# EAGLE board interface_board (EAGLE 7.1.0)
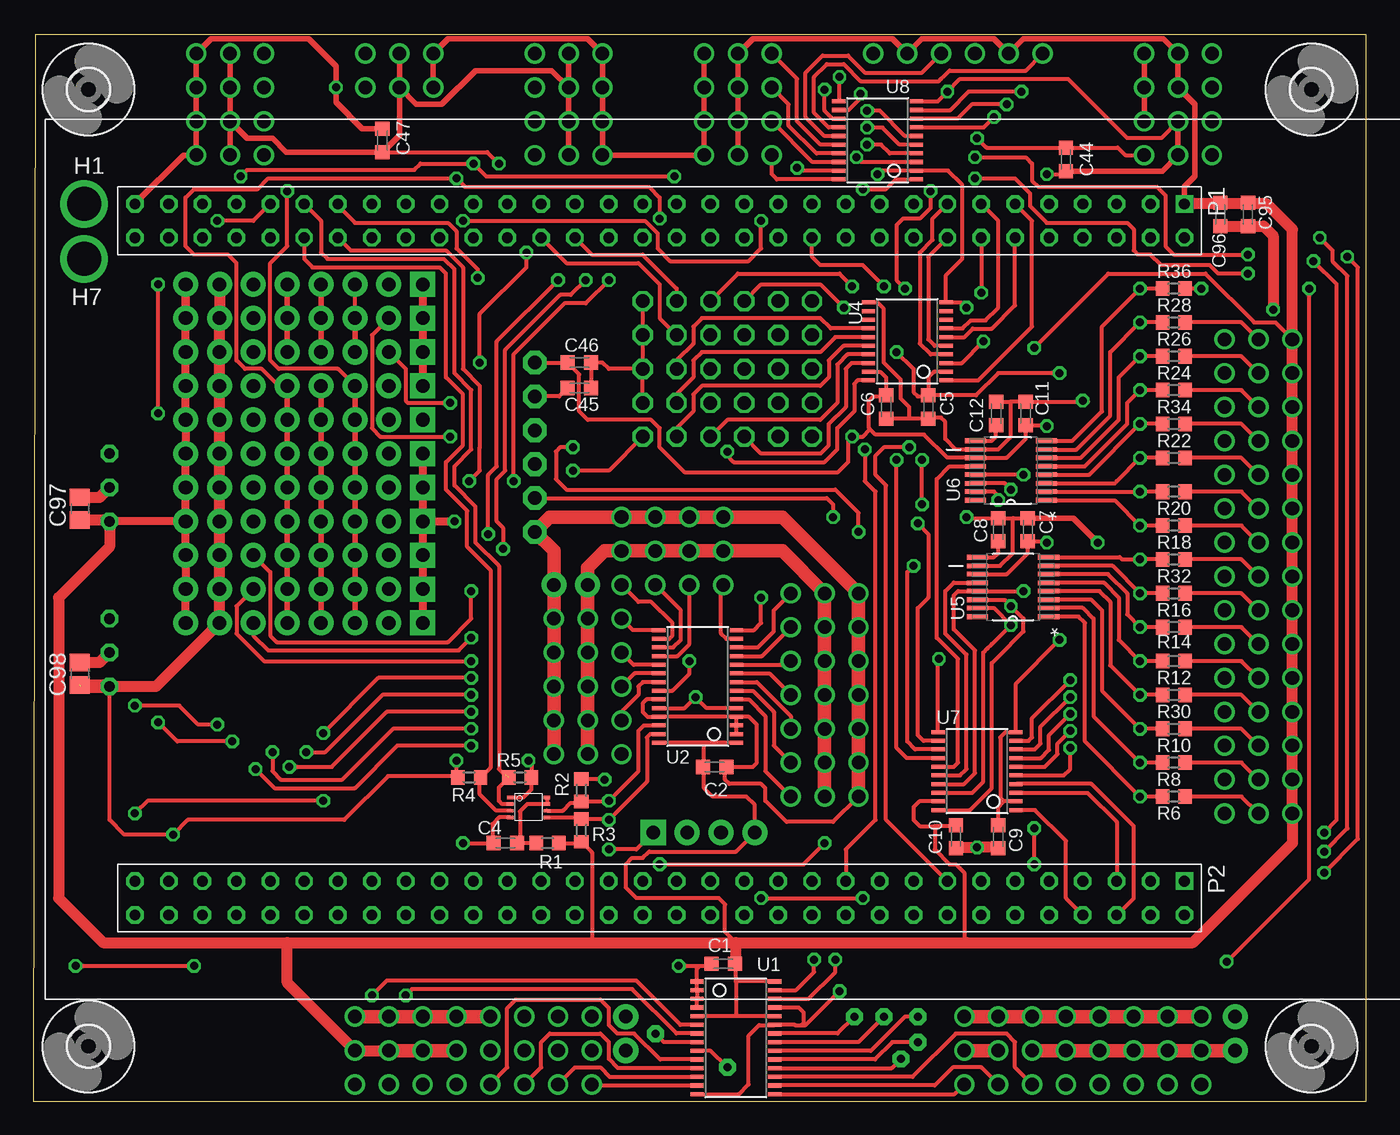
[diagram p5: board, top side]
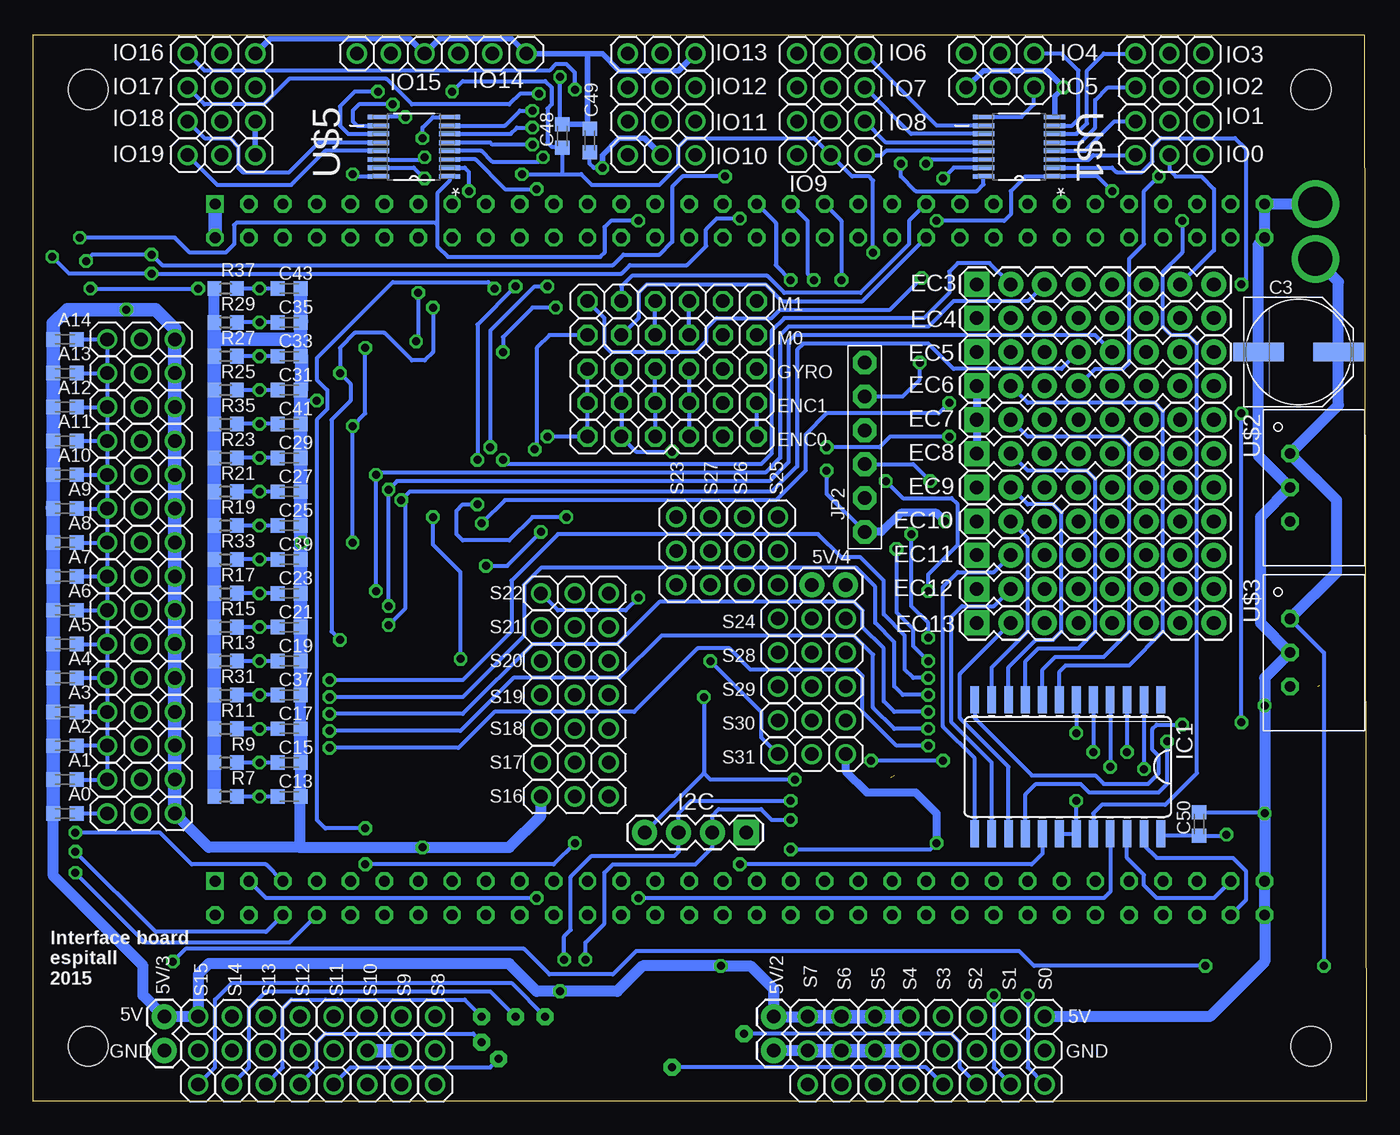
[diagram p6: board, bottom side, seen from below]

Size 100 x 80 mm. Coordinates in mm from the lower left corner, seen from the top.
Outline: 0,0 100,0 100,80 0.16,80 0,0
Copper layers (1*16): Top 0.035mm / dielectric 1.5mm / Bottom 0.035mm
Design rules "default *": minimum track width 10mil, minimum drill 10mil, track to track 6mil, track to pad 6mil, pad to pad 6mil, via to via 6mil, smd to smd 6mil, copper to edge 6mil, drill to drill 6mil, minimum pad ring 10mil, minimum via ring 8mil, stop-mask expansion 4mil, vias tented up to drill 0mil, thermal gap 10mil

## Footprints (pad centres in the part's own frame; a part is rotated, then mirrored left to right if it is on the bottom)
1X02 = drill 1.016 pad 1.88: 1 0,0; 2 2.54,0
1X03 = drill 1.016: 1 -2.54,0; 2 0,0; 3 2.54,0
C0603K = smd 1.05 x 1.08: 1 -0.875,0; 2 0.875,0
PANASONIC_E = smd 3.8 x 1.4: + 3,0; - -3,0
C0805 = smd 1.3 x 1.5: 1 -0.85,0; 2 0.85,0
1X08 = drill 1.016 pad 1.88 square: 1 0,0 | drill 1.016 pad 1.88: 2 2.54,0; 3 5.08,0; 4 7.62,0; 5 10.16,0; 6 12.7,0; 7 15.24,0; 8 17.78,0
1X06 = drill 1.016 octagon: 1 -6.35,0; 2 -3.81,0; 3 -1.27,0; 4 1.27,0; 5 3.81,0; 6 6.35,0
PAD_0.1000 = drill 2.54 pad 2.54: 1 0,0
3,0 = hole 3: 0,0
1X04 = drill 1.016 pad 1.88 square: 1 0,0 | drill 1.016 pad 1.88: 2 2.54,0; 3 5.08,0; 4 7.62,0
SO24W = smd 0.66 x 2.032: 1 -6.985,-5.029; 2 -5.715,-5.029; 3 -4.445,-5.029; 4 -3.175,-5.029; 5 -1.905,-5.029; 6 -0.635,-5.029; 7 0.635,-5.029; 8 1.905,-5.029; 9 3.175,-5.029; 10 4.445,-5.029; 11 5.715,-5.029; 12 6.985,-5.029; 13 6.985,5.029; 14 5.715,5.029; 15 4.445,5.029; 16 3.175,5.029; 17 1.905,5.029; 18 0.635,5.029; 19 -0.635,5.029; 20 -1.905,5.029; 21 -3.175,5.029; 22 -4.445,5.029; 23 -5.715,5.029; 24 -6.985,5.029
1X06-BIG = drill 1.016 pad 1.778 octagon: 1 -6.35,0; 2 -3.81,0; 3 -1.27,0; 4 1.27,0; 5 3.81,0; 6 6.35,0
R0603 = smd 1 x 1.1: 1 -0.85,0; 2 0.85,0
TSSOP28 = smd 0.305 x 0.991: 1 -4.225,-2.918; 2 -3.575,-2.918; 3 -2.925,-2.918; 4 -2.275,-2.918; 5 -1.625,-2.918; 6 -0.975,-2.918; 7 -0.325,-2.918; 8 0.325,-2.918; 9 0.975,-2.918; 10 1.625,-2.918; 11 2.275,-2.918; 12 2.925,-2.918; 13 3.575,-2.918; 14 4.225,-2.918; 15 4.225,2.918; 16 3.575,2.918; 17 2.925,2.918; 18 2.275,2.918; 19 1.625,2.918; 20 0.975,2.918; 21 0.325,2.918; 22 -0.325,2.918; 23 -0.975,2.918; 24 -1.625,2.918; 25 -2.275,2.918; 26 -2.925,2.918; 27 -3.575,2.918; 28 -4.225,2.918
PSOP-8 = smd 0.25 x 0.5: 1 -0.73,-1.37; 2 -0.23,-1.37; 3 0.27,-1.37; 4 0.77,-1.37; 5 0.77,1.38; 6 0.27,1.38; 7 -0.23,1.38; 8 -0.73,1.38
TSSOP20 = smd 0.305 x 0.991: 1 -2.925,-2.918; 2 -2.275,-2.918; 3 -1.625,-2.918; 4 -0.975,-2.918; 5 -0.325,-2.918; 6 0.325,-2.918; 7 0.975,-2.918; 8 1.625,-2.918; 9 2.275,-2.918; 10 2.925,-2.918; 11 2.925,2.918; 12 2.275,2.918; 13 1.625,2.918; 14 0.975,2.918; 15 0.325,2.918; 16 -0.325,2.918; 17 -0.975,2.918; 18 -1.625,2.918; 19 -2.275,2.918; 20 -2.925,2.918
SOP63P602X175-16N = smd 1.6 x 0.356: 1 -2.667,2.235; 2 -2.667,1.575; 3 -2.667,0.965; 4 -2.667,0.305; 5 -2.667,-0.305; 6 -2.667,-0.965; 7 -2.667,-1.575; 8 -2.667,-2.235; 9 2.667,-2.235; 10 2.667,-1.575; 11 2.667,-0.965; 12 2.667,-0.305; 13 2.667,0.305; 14 2.667,0.965; 15 2.667,1.575; 16 2.667,2.235
SOP63P600X175-16N = smd 1.6 x 0.356: 1 -2.667,2.235; 2 -2.667,1.575; 3 -2.667,0.965; 4 -2.667,0.305; 5 -2.667,-0.305; 6 -2.667,-0.965; 7 -2.667,-1.575; 8 -2.667,-2.235; 9 2.667,-2.235; 10 2.667,-1.575; 11 2.667,-0.965; 12 2.667,-0.305; 13 2.667,0.305; 14 2.667,0.965; 15 2.667,1.575; 16 2.667,2.235
TSR-1 = drill 0.8 octagon: P$1 0,0; P$2 2.54,0; P$3 5.08,0
STM32F429IDISCOVERY = drill 0.8 square: P$1 -27.94,35.56; P$65 22.86,35.56 | drill 0.8 octagon: P$2 -25.4,35.56; P$3 -27.94,33.02; P$4 -25.4,33.02; P$5 -27.94,30.48; P$6 -25.4,30.48; P$7 -27.94,27.94; P$8 -25.4,27.94; P$9 -27.94,25.4; P$10 -25.4,25.4; P$11 -27.94,22.86; P$12 -25.4,22.86; P$13 -27.94,20.32; P$14 -25.4,20.32; P$15 -27.94,17.78; P$16 -25.4,17.78; P$17 -27.94,15.24; P$18 -25.4,15.24; P$19 -27.94,12.7; P$20 -25.4,12.7; P$21 -27.94,10.16; P$22 -25.4,10.16; P$23 -27.94,7.62; P$24 -25.4,7.62; P$25 -27.94,5.08; P$26 -25.4,5.08; P$27 -27.94,2.54; P$28 -25.4,2.54; P$29 -27.94,0; P$30 -25.4,0; P$31 -27.94,-2.54; P$32 -25.4,-2.54; P$33 -27.94,-5.08; P$34 -25.4,-5.08; P$35 -27.94,-7.62; P$36 -25.4,-7.62; P$37 -27.94,-10.16; P$38 -25.4,-10.16; P$39 -27.94,-12.7; P$40 -25.4,-12.7; P$41 -27.94,-15.24; P$42 -25.4,-15.24; P$43 -27.94,-17.78; P$44 -25.4,-17.78; P$45 -27.94,-20.32; P$46 -25.4,-20.32; P$47 -27.94,-22.86; P$48 -25.4,-22.86; P$49 -27.94,-25.4; P$50 -25.4,-25.4; P$51 -27.94,-27.94; P$52 -25.4,-27.94; P$53 -27.94,-30.48; P$54 -25.4,-30.48; P$55 -27.94,-33.02; P$56 -25.4,-33.02; P$57 -27.94,-35.56; P$58 -25.4,-35.56; P$59 -27.94,-38.1; P$60 -25.4,-38.1; P$61 -27.94,-40.64; P$62 -25.4,-40.64; P$63 -27.94,-43.18; P$64 -25.4,-43.18; P$66 25.4,35.56; P$67 22.86,33.02; P$68 25.4,33.02; P$69 22.86,30.48; P$70 25.4,30.48; P$71 22.86,27.94; P$72 25.4,27.94; P$73 22.86,25.4; P$74 25.4,25.4; P$75 22.86,22.86; P$76 25.4,22.86; P$77 22.86,20.32; P$78 25.4,20.32; P$79 22.86,17.78; P$80 25.4,17.78; P$81 22.86,15.24; P$82 25.4,15.24; P$83 22.86,12.7; P$84 25.4,12.7; P$85 22.86,10.16; P$86 25.4,10.16; P$87 22.86,7.62; P$88 25.4,7.62; P$89 22.86,5.08; P$90 25.4,5.08; P$91 22.86,2.54; P$92 25.4,2.54; P$93 22.86,0; P$94 25.4,0; P$95 22.86,-2.54; P$96 25.4,-2.54; P$97 22.86,-5.08; P$98 25.4,-5.08; P$99 22.86,-7.62; P$100 25.4,-7.62; P$101 22.86,-10.16; P$102 25.4,-10.16; P$103 22.86,-12.7; P$104 25.4,-12.7; P$105 22.86,-15.24; P$106 25.4,-15.24; P$107 22.86,-17.78; P$108 25.4,-17.78; P$109 22.86,-20.32; P$110 25.4,-20.32; P$111 22.86,-22.86; P$112 25.4,-22.86; P$113 22.86,-25.4; P$114 25.4,-25.4; P$115 22.86,-27.94; P$116 25.4,-27.94; P$117 22.86,-30.48; P$118 25.4,-30.48; P$119 22.86,-33.02; P$120 25.4,-33.02; P$121 22.86,-35.56; P$122 25.4,-35.56; P$123 22.86,-38.1; P$124 25.4,-38.1; P$125 22.86,-40.64; P$126 25.4,-40.64; P$127 22.86,-43.18; P$128 25.4,-43.18

## Placement (x,y rotation side)
5V/2  M02PTH  [1X02]  44.45,6.35 270 bottom
5V/3  M02PTH  [1X02]  90.17,6.35 270 bottom
5V/4  M02PTH  [1X02]  39.05,38.73 180 bottom
A0  [1X03]  91.92,21.59 0 bottom
A1  [1X03]  91.92,24.13 0 bottom
A2  [1X03]  91.92,26.67 0 bottom
A3  [1X03]  91.92,29.21 0 bottom
A4  [1X03]  91.92,31.75 0 bottom
A5  [1X03]  91.92,34.29 0 bottom
A6  [1X03]  91.92,36.83 0 bottom
A7  [1X03]  91.92,39.37 0 bottom
A8  [1X03]  91.92,41.91 0 bottom
A9  [1X03]  91.92,44.45 0 bottom
A10  [1X03]  91.92,46.99 0 bottom
A11  [1X03]  91.92,49.53 0 bottom
A12  [1X03]  91.92,52.07 0 bottom
A13  [1X03]  91.92,54.61 0 bottom
A14  [1X03]  91.92,57.15 0 bottom
C1  [C0603K]  51.75,10.32 180 top
C2  [C0603K]  51.12,25.08 0 top
C3  100u/25V  [PANASONIC_E]  5.08,56.2 0 bottom
C4  100n  [C0603K]  35.4,19.37 180 top
C5  100n  [C0603K]  67.15,52.07 270 top
C6  100n  [C0603K]  63.98,52.07 270 top
C7  100n  [C0603K]  74.61,42.86 90 top
C8  100n  [C0603K]  72.39,42.86 90 top
C9  100n  [C0603K]  72.39,19.84 270 top
C10  100n  [C0603K]  69.22,19.84 270 top
C11  100n  [C0603K]  74.45,51.59 90 top
C12  100n  [C0603K]  72.23,51.59 90 top
C13  [C0603K]  80.8,22.86 0 bottom
C14  100n  [C0603K]  97.63,21.59 180 bottom
C15  [C0603K]  80.8,25.4 0 bottom
C16  100n  [C0603K]  97.63,57.15 180 bottom
C17  [C0603K]  80.8,27.94 0 bottom
C18  100n  [C0603K]  97.63,54.61 180 bottom
C19  [C0603K]  80.8,33.02 0 bottom
C20  100n  [C0603K]  97.63,49.53 180 bottom
C21  [C0603K]  80.8,35.56 0 bottom
C22  100n  [C0603K]  97.63,46.99 180 bottom
C23  [C0603K]  80.8,38.1 0 bottom
C24  100n  [C0603K]  97.63,44.45 180 bottom
C25  [C0603K]  80.8,43.18 0 bottom
C26  100n  [C0603K]  97.63,39.37 180 bottom
C27  [C0603K]  80.8,45.72 0 bottom
C28  100n  [C0603K]  97.63,36.83 180 bottom
C29  [C0603K]  80.8,48.26 0 bottom
C30  100n  [C0603K]  97.63,34.29 180 bottom
C31  [C0603K]  80.8,53.34 0 bottom
C32  100n  [C0603K]  97.63,29.21 180 bottom
C33  [C0603K]  80.8,55.88 0 bottom
C34  100n  [C0603K]  97.63,26.67 180 bottom
C35  [C0603K]  80.8,58.42 0 bottom
C36  100n  [C0603K]  97.63,24.13 180 bottom
C37  [C0603K]  80.8,30.48 0 bottom
C38  100n  [C0603K]  97.63,52.07 180 bottom
C39  [C0603K]  80.8,40.64 0 bottom
C40  100n  [C0603K]  97.63,41.91 180 bottom
C41  [C0603K]  80.8,50.8 0 bottom
C42  100n  [C0603K]  97.63,31.75 180 bottom
C43  [C0603K]  80.8,60.96 0 bottom
C44  100n  [C0603K]  77.47,70.64 90 top
C45  100n  [C0603K]  40.96,53.5 0 top
C46  100n  [C0603K]  40.96,55.4 0 top
C47  100n  [C0603K]  26.19,72.07 90 top
C48  100n  [C0603K]  60.33,72.39 90 bottom
C49  100n  [C0603K]  58.26,72.07 90 bottom
C50  100n  [C0603K]  12.54,20.8 90 bottom
C95  100n  [C0603K]  91.12,66.52 270 top
C96  100n  [C0603K]  89.06,66.52 270 top
C97  [C0805]  3.49,44.45 90 top
C98  [C0805]  3.49,32.07 90 top
EC3  [1X08]  29.21,61.28 0 bottom
EC4  [1X08]  29.21,58.74 0 bottom
EC5  [1X08]  29.21,56.2 0 bottom
EC6  [1X08]  29.21,53.66 0 bottom
EC7  [1X08]  29.21,51.12 0 bottom
EC8  [1X08]  29.21,48.58 0 bottom
EC9  [1X08]  29.21,46.04 0 bottom
EC10  [1X08]  29.21,43.5 0 bottom
EC11  [1X08]  29.21,40.96 0 bottom
EC12  [1X08]  29.21,38.42 0 bottom
EC13  [1X08]  29.21,35.88 0 bottom
ENC0  [1X06]  52.07,49.85 180 bottom
ENC1  [1X06]  52.07,52.39 180 bottom
GYRO  [1X06]  52.07,54.93 180 bottom
H1  SPECIAL_DRILL_0.1000  [PAD_0.1000]  3.81,67.31 0 top
H3  MOUNT-HOLE3.0  [3,0]  4.13,75.88 0 top
H4  MOUNT-HOLE3.0  [3,0]  4.13,4.13 0 top
H5  MOUNT-HOLE3.0  [3,0]  95.89,75.88 0 top
H6  MOUNT-HOLE3.0  [3,0]  95.89,4.13 0 top
H7  SPECIAL_DRILL_0.1000  [PAD_0.1000]  3.81,63.18 0 top
I2C  [1X04]  46.51,20.16 180 bottom
IC1  74HC154DW  [SO24W]  22.38,25.08 180 bottom
IO0  [1X03]  14.76,70.96 0 bottom
IO1  [1X03]  14.76,73.5 0 bottom
IO2  [1X03]  14.76,76.04 0 bottom
IO3  [1X03]  14.76,78.58 0 bottom
IO4  [1X03]  27.46,78.58 180 bottom
IO5  [1X03]  27.46,76.04 180 bottom
IO6  [1X03]  40.16,78.58 180 bottom
IO7  [1X03]  40.16,76.04 180 bottom
IO8  [1X03]  40.16,73.5 180 bottom
IO9  [1X03]  40.16,70.96 180 bottom
IO10  [1X03]  52.86,70.96 0 bottom
IO11  [1X03]  52.86,73.5 0 bottom
IO12  [1X03]  52.86,76.04 0 bottom
IO13  [1X03]  52.86,78.58 0 bottom
IO14  [1X03]  65.56,78.58 0 bottom
IO15  [1X03]  73.18,78.58 0 bottom
IO16  [1X03]  85.88,78.58 0 bottom
IO17  [1X03]  85.88,76.04 0 bottom
IO18  [1X03]  85.88,73.5 0 bottom
IO19  [1X03]  85.88,70.96 0 bottom
JP2  [1X06-BIG]  37.62,49.05 270 bottom
M0  [1X06]  52.07,57.47 180 bottom
M1  [1X06]  52.07,60.01 180 bottom
R1  200k  [R0603]  38.58,19.37 0 top
R2  4k7  [R0603]  41.12,23.34 90 top
R3  4k7  [R0603]  41.12,20.32 270 top
R4  4k7  [R0603]  32.7,24.29 180 top
R5  4k7  [R0603]  36.51,24.29 0 top
R6  [R0603]  85.57,22.86 0 top
R7  [R0603]  85.57,22.86 180 bottom
R8  [R0603]  85.57,25.4 0 top
R9  [R0603]  85.57,25.4 180 bottom
R10  [R0603]  85.57,27.94 0 top
R11  [R0603]  85.57,27.94 180 bottom
R12  [R0603]  85.57,33.02 0 top
R13  [R0603]  85.57,33.02 180 bottom
R14  [R0603]  85.57,35.56 0 top
R15  [R0603]  85.57,35.56 180 bottom
R16  [R0603]  85.57,38.1 0 top
R17  [R0603]  85.57,38.1 180 bottom
R18  [R0603]  85.57,43.18 0 top
R19  [R0603]  85.57,43.18 180 bottom
R20  [R0603]  85.57,45.72 0 top
R21  [R0603]  85.57,45.72 180 bottom
R22  [R0603]  85.57,48.26 0 top
R23  [R0603]  85.57,48.26 180 bottom
R24  [R0603]  85.57,53.34 0 top
R25  [R0603]  85.57,53.34 180 bottom
R26  [R0603]  85.57,55.88 0 top
R27  [R0603]  85.57,55.88 180 bottom
R28  [R0603]  85.57,58.42 0 top
R29  [R0603]  85.57,58.42 180 bottom
R30  [R0603]  85.57,30.48 0 top
R31  [R0603]  85.57,30.48 180 bottom
R32  [R0603]  85.57,40.64 0 top
R33  [R0603]  85.57,40.64 180 bottom
R34  [R0603]  85.57,50.8 0 top
R35  [R0603]  85.57,50.8 180 bottom
R36  [R0603]  85.57,60.96 0 top
R37  [R0603]  85.57,60.96 180 bottom
S0  [1X03]  24.13,3.81 90 bottom
S1  [1X03]  26.67,3.81 90 bottom
S2  [1X03]  29.21,3.81 90 bottom
S3  [1X03]  31.75,3.81 90 bottom
S4  [1X03]  34.29,3.81 90 bottom
S5  [1X03]  36.83,3.81 90 bottom
S6  [1X03]  39.37,3.81 90 bottom
S7  [1X03]  41.91,3.81 90 bottom
S8  [1X03]  69.85,3.81 90 bottom
S9  [1X03]  72.39,3.81 90 bottom
S10  [1X03]  74.93,3.81 90 bottom
S11  [1X03]  77.47,3.81 90 bottom
S12  [1X03]  80.01,3.81 90 bottom
S13  [1X03]  82.55,3.81 90 bottom
S14  [1X03]  85.09,3.81 90 bottom
S15  [1X03]  87.63,3.81 90 bottom
S16  [1X03]  59.37,22.86 180 bottom
S17  [1X03]  59.37,25.4 180 bottom
S18  [1X03]  59.37,27.94 180 bottom
S19  [1X03]  59.37,30.48 180 bottom
S20  [1X03]  59.37,33.02 180 bottom
S21  [1X03]  59.37,35.56 180 bottom
S22  [1X03]  59.37,38.1 180 bottom
S23  [1X03]  51.75,41.27 90 bottom
S24  [1X03]  41.59,36.2 0 bottom
S25  [1X03]  44.13,41.27 90 bottom
S26  [1X03]  46.67,41.27 90 bottom
S27  [1X03]  49.21,41.27 90 bottom
S28  [1X03]  41.59,33.66 0 bottom
S29  [1X03]  41.59,31.11 0 bottom
S30  [1X03]  41.59,28.57 0 bottom
S31  [1X03]  41.59,26.04 0 bottom
U1  [TSSOP28]  52.7,4.76 270 top
U2  [TSSOP28]  49.85,31.11 90 top
U3  PCA9306  [PSOP-8]  37.15,22.07 270 top
U4  [TSSOP20]  65.56,56.99 90 top
U5  MAX11628EEE+  [SOP63P602X175-16N]  73.5,38.58 180 top
U6  MAX11628EEE+  [SOP63P602X175-16N]  73.34,47.31 180 top
U7  [TSSOP20]  70.8,24.77 90 top
U8  [TSSOP20]  63.34,72.07 90 top
U$1  MAX7317  [SOP63P600X175-16N]  26.04,71.6 180 bottom
U$2  TSR_1-2450  [TSR-1]  5.71,48.58 270 bottom
U$3  TSR_1-2433  [TSR-1]  5.71,36.2 270 bottom
U$4  STM32F429IDISCOVERY  [STM32F429IDISCOVERY]  50.8,39.37 270 top
U$5  MAX7317  [SOP63P600X175-16N]  71.44,71.6 180 bottom

## Tracks (layer width: path | path; a pad name or v marks a point on that pad's centre or on a via)
+3V3  (via drill 0.6, 0.6 pad 1.02)  (1 unrouted)
  Top 0.305: U8.10 67.85,75 v68.58,75.72 69.53,76.68 77.63,76.68 82.07,72.23 84.61,72.23 IO18.2 | v76.04,69.53 77.23,69.53 C44.1 | C9.1 72.39,22.07 72.81,22.49 | U7.2 72.81,22.49 | U4.2 67.58,54.72 67.15,54.29 C5.1 | C47.1 34.05,71.2 v34.92,70.33 | U3.1 36.77,22.8 37.36,23.39 R5.2 37.36,25.34 v37.15,25.56 | R4.2 31.75,24.39 | 31.75,24.39 v31.75,25.56 | U$3.P$3 5.71,21.11 6.83,20 v10.48,20 11.59,21.11 23.34,21.11 26.61,24.39 31.75,24.39 | 72.81,22.49 72.55,22.75 72.55,27.3 72.93,27.69 U7.10 73.72,31.33 v76.99,34.61 | v76.99,54.61 72.39,54.61 70.72,52.95 C5.1 | v63.34,69.53 63.61,69.8 U8.2 68.63,69.8 69.69,68.74 69.69,63.18 68.48,61.97 U4.10 69.62,59.92 v70.01,59.53 | M1.4 54.61,61.28 59.05,61.28 v60.8,59.53 | C5.1 67.07,52.86 66.36,52.86 66.04,53.18 66.04,54.93 v64.77,56.2 | v33.5,55.4 33.5,59.05 36.99,62.55 v36.99,63.66 | C45.1 39.45,52.86 JP2.2
  Top 0.406: IO5.2 27.46,72.47 C47.1 18.97,71.2 17.94,72.23 16.03,72.23 IO1.2 | IO5.2 IO4.2 | IO1.2 IO0.2 | IO1.2 IO2.2 IO3.2 | IO7.2 IO8.2 IO9.2 | IO7.2 38.89,77.31 33.18,77.31 30.64,74.77 28.73,74.77 IO5.2 | IO6.2 IO7.2 | IO18.2 IO19.2 84.69,69.77 C44.1
  Top 0.61: EC4.7 EC5.7 EC6.7 EC7.7 EC8.7 EC9.7 EC10.7 EC11.7 EC12.7
  Top 0.813: U$3.P$3 9.21,31.11 EC13.7 EC4.7 EC3.7
  Top 1.016: U$3.P$3 3.6,31.11
  Bottom 0.305: 60.33,69.53 C48.1 60.41,71.6 61.12,71.6 61.44,71.91 61.44,74.45 61.12,74.77 61.12,76.04 61.59,76.52 67.79,76.52 v68.58,75.72 | U$5.16 75.87,69.36 v76.04,69.53 | M0.4 M1.4 | U$1.16 28.7,68.77 29.21,68.26 33.81,68.26 34.92,69.37 v34.92,70.33 | v31.75,25.56 v37.15,25.56 | IC1.24 15.27,19.92 C50.1 10.56,19.92 v10.48,20 | IO0.2 14.76,69.85 14.29,69.37 12.38,69.37 11.43,68.42 11.43,63.82 EC3.7 | v76.99,34.61 77.63,35.24 77.63,51.12 76.2,52.55 76.2,53.82 v76.99,54.61 76.99,56.52 75.88,57.63 73.66,57.63 71.6,55.56 70.64,55.56 70.01,56.2 v70.01,59.53 | v60.8,59.53 62.55,59.53 64.77,57.31 v64.77,56.2 | v63.34,69.53 60.33,69.53 | 60.33,69.53 58.9,69.53 58.1,68.74 53.02,68.74 51.59,70.17 51.59,71.6 50.96,72.23 41.43,72.23 IO9.2 38.58,69.37 37.31,69.37 36.99,69.06 v36.99,63.66 | JP2.2 34.77,52.86 33.5,54.13 v33.5,55.4
+5V/1  (via drill 0.6, 0.6 pad 1.02)
  Top 0.305: U1.24 52.7,6.39 | 52.7,6.39 U1.5 | 52.7,8.99 52.7,6.39 | U1.28 52.7,8.99 | U8.19 57.52,69.8 v57.31,70.01 | U5.11 73.04,39.54 74.61,41.12 C7.1 75.96,41.99 v76.04,41.91 | C11.1 74.45,49.69 73.04,48.27 U6.11 68.57,48.27 66.83,50.01 63.18,50.01 62.79,50.4 | 74.53,50.64 C11.1 | U7.19 66.46,22.49 66.04,22.07 66.04,21.11 66.52,20.64 67.63,20.64 | U4.19 63.55,54.72 63.98,54.29 C6.1 63.9,52.86 63.02,52.86 62.71,52.55 62.71,50.48 62.79,50.4 | R1.2 41.01,19.37 R3.2 41.91,18.68 41.91,11.91 | 52.7,8.99 52.7,10.24 C1.1 | 50.16,25 C2.1 50.32,25 | 52.7,11.91 51.91,12.7 51.91,14.76 51.44,15.24 45.24,15.24 44.45,16.03 44.45,17.78 44.93,18.26 45.72,18.26 46.2,18.73 52.7,18.73 I2C.4 54.13,22.23 53.5,22.86 50.96,22.86 50.32,23.5 50.32,25 | U2.1 50.32,26.89 | 50.32,26.89 U2.28 | 50.32,25 50.32,26.89 | U2.24 48.86,29.49 v49.69,30.32 50.52,29.49 U2.5 | R2.2 42.81,24.19 v42.86,24.13 | 67.63,20.64 69.13,20.64 C10.1 | 67.63,20.64 67.63,18.89 68.74,17.78 69.22,17.78 69.85,17.14 69.85,12.06 70.01,11.91 | JP2.1 C46.1 40.96,54.53 40.96,51.75 41.59,51.12 46.35,51.12 46.99,50.48 46.99,49.05 48.9,47.15 60.33,47.15 61.12,47.94 61.12,49.53 v61.44,49.85 62.23,49.85 62.79,50.4 | v75.09,56.52 80.64,62.07 87.95,62.07 91.6,58.42 93.19,58.42 A14.1 | C11.1 75.96,50.72 v76.04,50.64
  Top 0.406: IO10.2 IO11.2 IO12.2 IO13.2 53.98,79.69 64.45,79.69 IO14.2 66.67,79.69 72.07,79.69 IO15.2 74.3,79.69 84.77,79.69 IO16.2 IO17.2 87.15,74.77 87.15,69.37 86.36,68.58 U$4.P$1
  Top 0.61: EC3.8 EC4.8 | EC13.8 EC12.8 EC11.8 EC10.8 | EC10.8 EC9.8 EC8.8 EC7.8 EC6.8 EC5.8 EC4.8 | EC4.8 11.43,61.44 | EC10.8 U$2.P$3
  Top 0.813: 19.05,11.91 5.24,11.91 1.91,15.24 1.91,37.78 5.71,41.59 U$2.P$3 5.61,43.6 C97.1 | 19.05,11.91 41.91,11.91 52.7,11.91 | 52.7,11.91 70.01,11.91 87,11.91 94.46,19.37 94.46,21.27 94.61,21.43 A0.1 A1.1 A14.1 94.46,65.41 92.55,67.31 91.2,67.31 | 91.2,67.31 89.06,67.31 | 89.06,67.31 U$4.P$1 | C96.1 89.06,67.31 | C95.1 91.2,67.31 | 19.05,11.91 19.05,8.89 S0.2 S1.2 | C1.1 52.7,10.4 52.7,11.91
  Top 1.016: S3.2 S2.2 S1.2
  Bottom 0.305: A13.1 A14.1 C16.1 | A13.1 A12.1 | A12.1 A11.1 | A11.1 A10.1 | A10.1 A9.1 | A9.1 A8.1 | A8.1 A7.1 | A7.1 A6.1 | A6.1 A5.1 | A5.1 A4.1 | A4.1 A3.1 | A3.1 A2.1 | A2.1 A1.1 C36.1 | C18.1 A13.1 | C38.1 A12.1 | C20.1 A11.1 | C22.1 A10.1 | C24.1 A9.1 | C40.1 A8.1 | C26.1 A7.1 | C28.1 A6.1 | C30.1 A5.1 | C32.1 A3.1 | C42.1 A4.1 | v57.31,70.01 57.94,70.01 58.26,70.33 C49.1 | v76.04,41.91 v76.04,50.64 75.09,51.59 v75.09,56.52 | A2.1 C34.1 | C14.1 A0.1 | v49.69,30.32 49.69,24.61 | 49.69,24.61 I2C.4 | v42.86,24.13 49.21,24.13 49.69,24.61 | GYRO.6 ENC1.6 ENC0.6 v61.44,49.85
  Bottom 0.406: v57.31,70.01 57.31,70.96 56.04,72.23 54.13,72.23 IO10.2
  Bottom 1.016: U$4.P$1 U$4.P$2
+5V/2
  Bottom 0.813: S7.2 5V/2.2
  Bottom 1.016: S4.2 S5.2 S6.2 S7.2
+5V/3
  Top 1.016: S10.2 S11.2 S12.2 S13.2 S14.2 S15.2 5V/3.2 | S9.2 S8.2
  Bottom 1.016: S10.2 S9.2
+5V/4
  Top 1.016: S16.2 S17.2 S18.2 S19.2 S20.2 S21.2 S22.2 56.2,41.27 S23.2 S27.2 S26.2 S25.2 42.86,41.27 41.59,40.01 5V/4.2 S24.2 S28.2 S29.2 S30.2 S31.2
ADC_CH0  (via drill 0.6 pad 1.02)
  Top 0.305: R7.1 v83.03,22.86 78.9,26.99 78.9,35.88 78.42,36.35 76.18,36.35 U5.1
  Bottom 0.305: C13.1 v83.03,22.86 R7.1
ADC_CH1  (via drill 0.6 pad 1.02)
  Top 0.305: R9.1 v83.03,25.4 79.53,28.89 79.53,36.2 78.73,37 U5.2
  Bottom 0.305: C15.1 v83.03,25.4 R9.1
ADC_CH2  (via drill 0.6 pad 1.02)
  Top 0.305: R11.1 v83.03,27.94 80.17,30.8 80.17,36.83 79.39,37.61 U5.3
  Bottom 0.305: C17.1 v83.03,27.94 R11.1
ADC_CH3  (via drill 0.6 pad 1.02)
  Top 0.305: R31.1 v83.03,30.48 80.8,32.7 80.8,37.47 80,38.27 U5.4
  Bottom 0.305: C37.1 v83.03,30.48 R31.1
ADC_CH4  (via drill 0.6 pad 1.02)
  Top 0.305: R13.1 v83.03,33.02 81.44,34.61 81.44,37.78 80.34,38.88 U5.5
  Bottom 0.305: C19.1 v83.03,33.02 R13.1
ADC_CH5  (via drill 0.6 pad 1.02)
  Top 0.305: R15.1 v83.03,35.56 82.07,36.51 82.07,38.1 80.63,39.54 U5.6
  Bottom 0.305: C21.1 v83.03,35.56 R15.1
ADC_CH6  (via drill 0.6 pad 1.02)
  Top 0.305: R17.1 v83.03,38.1 80.97,40.15 U5.7
  Bottom 0.305: C23.1 v83.03,38.1 R17.1
ADC_CH7  (via drill 0.6 pad 1.02)
  Top 0.305: R33.1 v83.03,40.64 | 83.01,40.65 v83.03,40.64 | U5.8 81.51,40.81 C39.1 v83.03,40.64
  Bottom 0.305: C39.1 v83.03,40.64 R33.1
ADC_CH8  (via drill 0.6 pad 1.02)
  Top 0.305: R19.1 v83.03,43.18 81.13,45.07 U6.1
  Bottom 0.305: C25.1 v83.03,43.18 R19.1
ADC_CH9  (via drill 0.6 pad 1.02)
  Top 0.305: R21.1 v83.03,45.72 | 83.01,45.73 arc-90 v83.03,45.72 | U6.2 83.01,45.73 | 83.01,45.73 v83.03,45.72
  Bottom 0.305: C27.1 v83.03,45.72 R21.1
ADC_CH10  (via drill 0.6 pad 1.02)
  Top 0.305: R23.1 v83.03,48.26 81.28,46.51 81.11,46.34 U6.3
  Bottom 0.305: C29.1 v83.03,48.26 R23.1
ADC_CH11  (via drill 0.6 pad 1.02)
  Top 0.305: R35.1 v83.03,50.8 79.23,47 U6.4
  Bottom 0.305: C41.1 v83.03,50.8 R35.1
ADC_CH12  (via drill 0.6 pad 1.02)
  Top 0.305: R25.1 v83.03,53.34 82.07,52.39 82.07,50.8 78.89,47.61 U6.5
  Bottom 0.305: C31.1 v83.03,53.34 R25.1
ADC_CH13  (via drill 0.6 pad 1.02)
  Top 0.305: R27.1 v83.03,55.88 81.44,54.29 81.44,51.12 78.59,48.27 U6.6
  Bottom 0.305: C33.1 v83.03,55.88 R27.1
ADC_CH14  (via drill 0.6 pad 1.02)
  Top 0.305: R29.1 v83.03,58.42 80.8,56.2 80.8,51.44 78.25,48.88 U6.7
  Bottom 0.305: C35.1 v83.03,58.42 R29.1
ADC_CH15  (via drill 0.6 pad 1.02)
  Top 0.305: R37.1 v83.03,60.96 | 83.01,60.97 v83.03,60.96 | v83.03,60.96 80.17,58.1 80.17,51.75 77.96,49.54 U6.8
  Bottom 0.305: C43.1 v83.03,60.96 R37.1
ALRM1_3V3  (via drill 0.6, 0.6 pad 1.02)
  Top 0.305: EC11.6 17.78,39.69 17.78,34.92 18.26,34.45 31.11,34.45 32.86,36.2 v32.86,38.26 | v43.18,61.59 41.43,59.85 39.85,59.85 36.04,56.04 v36.04,46.51
  Bottom 0.305: U$4.P$33 44.29,65.88 44.29,62.71 v43.18,61.59 | v36.04,46.51 34.77,45.24 31.11,45.24 30.64,44.77 30.64,41.75 32.86,39.53 v32.86,38.26
ALRM2_3V3  (via drill 0.6, 0.6 pad 1.02)
  Top 0.305: EC12.6 15.24,37.15 15.24,35.08 17.3,33.02 v32.86,33.02 | v41.43,61.59 40.32,60.48 39.53,60.48 35.4,56.36 35.4,47.31 34.77,46.67 34.77,43.5 35.24,43.02 v35.24,41.43
  Bottom 0.305: v32.86,33.02 33.97,34.13 33.97,35.4 35.24,36.67 v35.24,41.43 | U$4.P$35 41.91,66.04 41.91,62.07 v41.43,61.59
ALRM3_3V3  (via drill 0.6, 0.6 pad 1.02)
  Top 0.305: EC13.6 16.51,34.92 17.62,33.81 31.91,33.81 v32.86,34.77 | v34.13,42.55 34.13,46.99 34.77,47.62 34.77,56.99 v39.37,61.59
  Bottom 0.305: v32.86,34.77 32.86,35.88 34.13,37.15 v34.13,42.55 | U$4.P$37 39.37,66.04 v39.37,61.59
CS_3_3V3  (via drill 0.6)
  Top 0.305: v19.21,25.08 22.38,25.08 26.51,29.21 v32.86,29.21 | U7.7 75.59,25.74 76.2,26.35 76.2,27.46 v77.79,29.05
  Bottom 0.305: IC1.4 v19.21,25.08 | v77.79,29.05 67.79,29.05 62.55,34.29 56.2,34.29 53.02,37.47 38.42,37.47 37.78,36.83 37.78,35.56 36.2,33.97 36.2,30 35.4,29.21 v32.86,29.21
CS_3_5V  (via drill 0.6 pad 1.02)
  Top 0.305: U7.14 65.54,25.74 64.77,26.51 v64.77,48.1
  Bottom 0.305: EC3.2 28.26,62.87 30.64,62.87 31.27,62.23 31.27,60.64 33.18,58.74 43.66,58.74 44.61,57.78 44.61,48.58 45.4,47.78 64.45,47.78 v64.77,48.1
CS_4_3V3  (via drill 0.6)
  Top 0.305: v20.48,26.19 21.91,26.19 26.19,30.48 v32.86,30.48 | U7.8 75.13,26.39 75.56,26.83 75.56,28.1 v77.79,30.32
  Bottom 0.305: IC1.5 v20.48,26.19 | v77.79,30.32 67.79,30.32 63.18,34.92 63.18,38.73 61.91,40.01 38.26,40.01 36.83,38.58 36.83,37.15 36.83,36.67 36.83,35.88 35.4,34.45 35.4,31.11 34.77,30.48 v32.86,30.48
CS_4_5V  (via drill 0.6, 0.6 pad 1.02)
  Top 0.305: U7.13 66.16,26.39 65.56,26.99 65.56,39.69 v66.04,40.16 | EC4.2 25.4,57.47 25.4,50.48 26.04,49.85 v31.27,49.85 | v61.91,42.7 61.91,44.13 60.17,45.88 40.01,45.88 39.21,46.67 39.21,48.74 39.53,49.05 v40.48,49.05
  Bottom 0.305: v66.04,40.16 64.45,40.16 v61.91,42.7 | v31.27,49.85 35.72,49.85 36.51,49.05 v40.48,49.05
CS_5_3V3  (via drill 0.6)
  Top 0.305: v21.75,27.62 25.88,31.75 v32.86,31.75 | U7.9 74.67,27.04 74.93,27.3 74.93,28.73 v77.79,31.59
  Bottom 0.305: IC1.6 v21.75,27.62 | v77.79,31.59 67.79,31.59 64.14,35.24 64.14,39.05 60.64,42.55 41.12,42.55 39.37,40.8 37.94,40.8 36.2,39.05 36.2,37.78 36.2,37.47 36.2,36.51 34.61,34.92 34.61,32.38 33.97,31.75 v32.86,31.75
CS_5_5V  (via drill 0.6, 0.6 pad 1.02)
  Top 0.305: U7.12 66.78,27.04 66.36,27.46 66.36,36.99 67.15,37.78 67.15,42.55 v66.36,43.34 | EC5.2 27.94,54.93 27.94,52.55 28.1,52.39 v31.27,52.39
  Bottom 0.305: v66.36,43.34 64.61,45.09 44.29,45.09 42.07,47.31 42.07,50.01 40.48,51.59 32.07,51.59 v31.27,52.39
CS_6_3V3
  Bottom 0.305: IC1.7 23.02,32.23 22.54,32.7 17.78,32.7 15.24,35.24 15.24,51.75 15.88,52.39 25.4,52.39 EC6.2
CS_7_3V3
  Bottom 0.305: IC1.8 24.29,32.38 23.34,33.34 19.68,33.34 17.78,35.24 17.78,49.21 18.41,49.85 25.4,49.85 EC7.2
CS_8_3V3
  Bottom 0.305: IC1.9 25.56,33.02 24.61,33.97 21.59,33.97 20.32,35.24 20.32,46.67 20.95,47.31 25.4,47.31 EC8.2
CS_9_3V3
  Bottom 0.305: IC1.10 26.83,32.54 24.77,34.61 23.5,34.61 22.86,35.24 22.86,44.13 23.5,44.77 25.4,44.77 EC9.2
CS_10_3V3
  Bottom 0.305: IC1.11 28.1,32.54 25.4,35.24 25.4,42.23 EC10.2
CS_11_3V3
  Bottom 0.305: IC1.13 29.37,25.72 31.75,28.1 31.75,38.58 30.64,39.69 27.94,39.69 EC11.2
CS_12_3V3
  Bottom 0.305: IC1.14 28.1,25.4 31.11,28.42 31.11,36.35 30.32,37.15 27.94,37.15 EC12.2
CS_13_3V3
  Bottom 0.305: IC1.15 26.83,25.08 30.48,28.73 30.48,32.07 EC13.2
CS_ADC0_3V3  (via drill 0.6)
  Top 0.305: v16.67,24.92 18.1,23.5 24.13,23.5 27.3,26.67 v32.86,26.67 | U7.5 77.31,24.45 77.79,24.92 v77.79,26.51
  Bottom 0.305: IC1.2 v16.67,24.92 | v77.79,26.51 68.1,26.51 65.41,29.21 54.93,29.21 50.16,33.97 47.78,33.97 46.2,32.38 38.26,32.38 37.78,31.91 37.78,29.21 35.24,26.67 v32.86,26.67
CS_ADC0_5V
  Top 0.305: U5.12 70.82,38.89 69.06,38.89 68.42,38.26 68.42,35.08 70.01,33.5 70.01,24.92 69.53,24.44 U7.16
CS_ADC1_3V3  (via drill 0.6)
  Top 0.305: v17.94,26.19 17.94,24.77 18.57,24.13 23.18,24.13 26.99,27.94 v32.86,27.94 | U7.6 75.89,25.09 76.83,26.04 76.83,26.83 v77.79,27.78
  Bottom 0.305: IC1.3 v17.94,26.19 | v77.79,27.78 67.94,27.78 63.98,31.75 56.04,31.75 52.86,34.92 38.42,34.92 36.99,33.5 36.99,29.53 35.4,27.94 v32.86,27.94
CS_ADC1_5V
  Top 0.305: U6.12 70.66,47.62 68.74,47.62 67.79,46.67 67.79,34.77 69.37,33.18 69.37,25.4 69.06,25.09 U7.15
CS_ENC0_3V3
  Top 0.305: U4.5 67.64,56.67 67.15,57.15 67.15,63.34 U$4.P$16
CS_ENC0_5V
  Top 0.305: U4.16 60.79,56.67 59.69,55.56 59.69,54.29 59.05,53.66 50.16,53.66 49.53,53.02 49.53,51.75 48.26,50.48 ENC0.2
CS_ENC1_3V3
  Top 0.305: U4.6 69.86,57.32 70.48,57.94 71.91,57.94 73.66,59.69 U$4.P$12
CS_ENC1_5V
  Top 0.305: U4.15 60.17,57.32 59.05,56.2 50.16,56.2 49.53,55.56 49.53,54.29 48.26,53.02 ENC1.2
CS_GYRO_3V3
  Top 0.305: U4.7 69.71,57.97 70.33,58.58 71.44,58.58 72.39,59.53 72.39,66.04 U$4.P$13
CS_GYRO_5V
  Top 0.305: U4.14 59.83,57.97 59.05,58.74 50.16,58.74 49.53,58.1 49.53,56.83 48.26,55.56 GYRO.2
CS_IOE0_3V3  (via drill 0.6 pad 1.02)
  Top 0.305: v14.92,26.99 10.79,26.99 v9.37,28.42 | v9.37,51.59 v9.37,61.28
  Bottom 0.305: IC1.16 25.56,23.02 24.77,23.81 21.43,23.81 20.8,23.18 15.56,23.18 14.92,23.81 v14.92,26.99 | v9.37,28.42 v9.37,51.59 | U$1.2 19.06,70.02 18.73,69.69 16.83,69.69 16.03,70.48 16.03,71.6 15.4,72.23 9.84,72.23 9.05,71.44 9.05,61.59 v9.37,61.28
CS_IOE1_3V3  (via drill 0.6, 0.6 pad 1.02)
  Top 0.305: v67.31,68.26 67.31,66.99 66.52,66.2 65.25,66.2 64.77,65.72 64.77,61.59 v65.41,60.96 | v46.99,17.78 57.78,17.78 v59.37,19.37 | v75.09,17.78 v75.09,20.48
  Bottom 0.305: U$5.2 67.64,70.02 67.31,69.69 v67.31,68.26 | IC1.17 24.29,18.57 25.08,17.78 v46.99,17.78 | v59.37,19.37 60.96,17.78 v75.09,17.78 | v75.09,20.48 78.11,20.48 78.74,21.11 78.74,51.12 77.95,51.91 77.95,53.34 78.74,54.13 78.74,55.72 73.03,61.44 65.88,61.44 v65.41,60.96
CS_SEL0_3V3
  Bottom 0.305: IC1.23 16.67,19.21 15.72,18.26 10,18.26 9.05,17.3 9.05,15.08 U$4.P$126
CS_SEL1_3V3
  Bottom 0.305: U$4.P$125 11.43,15.24 15.72,15.24 16.67,16.19 16.67,16.99 17.94,18.26 IC1.22
CS_SEL2_3V3  (via drill 0.6)
  Top 0.305: v54.61,15.24 v62.23,15.24
  Bottom 0.305: IC1.21 19.21,15.72 19.68,15.24 v54.61,15.24 | v62.23,15.24 82.55,15.24 U$4.P$67
CS_SEL3_3V3  (via drill 0.6)
  Top 0.305: U$4.P$55 16.51,66.04 v13.81,66.04
  Bottom 0.305: v13.81,66.04 13.81,63.66 15.24,62.23 15.24,58.1 14.61,57.47 13.34,57.47 12.7,56.83 12.7,24.61 15.08,22.23 19.84,22.23 20.48,21.59 IC1.20
ERR_M0_3V3
  Top 0.305: U$4.P$40 40.01,62.87 45.4,62.87 46.99,61.28 46.99,58.74 M0.2
ERR_M1_3V3
  Top 0.305: U$4.P$38 41.91,63.5 45.72,63.5 48.26,60.96 M1.2
GND  (via drill 0.6, 0.6 pad 1.02)
  Top 0.305: U1.25 57.41,7.04 57.78,6.67 57.78,5.87 57.63,5.71 | U2.4 U2.3 U2.2 | U2.4 U2.25 46.09,28.84 45.72,29.21 45.72,29.84 46.02,30.14 U2.23 | U2.4 53.71,28.84 54.29,28.26 54.29,25.4 53.98,25.08 C2.2 51.91,25 51.91,24.13 52.23,23.81 54.61,23.81 54.93,23.5 54.93,22.54 56.52,20.95 60.01,20.95 S16.3 | U2.14 54.07,35.34 54.61,35.88 v54.61,37.78 | U1.4 U1.3 U1.2 U1.1 49.79,9.94 50.01,10.16 | U8.11 60.48,75.06 v60.48,76.83 | IO19.3 81.92,70.96 81.36,71.52 C44.2 71.52,71.52 v70.8,72.23 | U5.10 72.54,40.15 73.5,41.12 73.5,43.74 | 73.5,43.74 C8.2 70.09,43.74 v70.01,43.81 | 73.5,43.74 C7.2 | C12.2 73.34,52.47 | 73.34,52.47 73.34,49.85 72.38,48.88 U6.10 69.23,48.88 68.42,49.69 68.42,50.96 68.1,51.28 67.23,51.28 C5.2 65.72,51.2 | 73.34,52.47 C11.2 79.14,52.47 v78.74,52.55 | 65.72,51.2 C6.2 | U4.11 63.34,59.92 63.82,59.44 63.82,55.4 65.09,54.13 65.09,52.7 65.72,52.07 65.72,51.2 | U3.4 34.95,21.3 34.45,20.8 34.45,19.45 C4.2 v32.23,19.37 | U1.14 52.92,0.54 53.66,1.27 53.66,4.92 54.45,5.71 55.6,5.71 U1.23 57.13,5.74 57.15,5.71 57.63,5.71 | 50.01,10.16 50.72,10.16 C1.2 | v48.42,10.16 50.01,10.16 | v21.75,22.54 8.57,22.54 v7.62,21.59 | U7.11 67.89,33.12 v67.94,33.18 | I2C.1 45.24,18.89 v43.18,18.89 | 57.63,5.71 57.94,5.71 v60.48,8.26 | M1.1 M0.1 GYRO.1 | GYRO.1 43.18,54.93 42.7,55.4 C46.2 C45.2 | v13.81,28.26 12.38,28.26 10.95,29.69 v7.62,29.69 | ENC0.1 43.18,47.31 v40.48,47.31 | ENC1.1 GYRO.1
  Top 0.406: C47.2 24.68,72.95 22.7,74.93 v22.7,76.04 22.7,77.63 20.64,79.69 13.34,79.69 IO3.3 IO2.3 IO1.3 IO0.3 11.27,70.96 U$4.P$63 | IO5.3 IO4.3 31.11,79.69 41.59,79.69 IO6.3 IO7.3 IO8.3 IO9.3 IO10.3 IO11.3 IO12.3 IO13.3 | IO16.3 IO17.3 IO18.3 | v79.85,41.91 78.02,43.74 C7.2
  Top 0.61: EC3.1 EC4.1 EC5.1 EC6.1 | EC8.1 EC9.1 EC10.1 | EC10.1 EC11.1 EC12.1 EC13.1 | EC10.1 v31.59,43.5
  Top 0.813: C98.2 4.98,32.92 U$3.P$2 | C97.2 4.98,45.3 U$2.P$2 | C10.2 69.3,19.05 v70.8,19.05 72.31,19.05 C9.2 | v93.03,59.37 93.03,64.93 92.31,65.64 C95.2 C96.2
  Top 1.016: S4.3 S3.3 S2.3 S1.3 S0.3 | S8.3 S9.3 S10.3 S11.3 S12.3 S13.3 S14.3 S15.3 | S31.3 S30.3 S29.3 S28.3 S24.3 5V/4.1 39.05,41.27 JP2.6 38.73,43.81 S25.3 S26.3 S27.3 S23.3 56.2,43.81 S22.3 S21.3 S20.3 S19.3 S18.3 S17.3 S16.3
  Bottom 0.305: 79.93,55.96 C33.2 C31.2 | 79.93,46.35 C27.2 | 86.42,61.06 R37.2 | C24.2 98.58,44.53 | v54.61,37.78 55.56,36.83 60.64,36.83 S22.3 | C48.2 60.48,73.42 v60.48,76.83 | v70.8,72.23 70.8,73.03 70.01,73.82 68.78,73.82 U$5.8 | v79.85,41.91 79.93,43.81 | v78.74,52.55 79.77,52.55 79.93,52.7 | ENC0.1 ENC1.1 | IC1.18 IC1.19 v21.75,22.54 | C50.2 7.7,21.67 v7.62,21.59 | 79.77,33.18 C19.2 | v43.18,18.89 32.7,18.89 v32.23,19.37 | IC1.12 29.37,28.73 25.08,24.45 20.32,24.45 19.68,23.81 16.35,23.81 15.56,24.61 15.56,25.88 16.03,26.35 16.03,27.94 15.72,28.26 v13.81,28.26 | v40.48,47.31 40.48,45.56 JP2.6 | v67.94,33.18 67.94,39.69 70.01,41.75 v70.01,43.81
  Bottom 0.406: U$1.8 23.37,75.37 v22.7,76.04 23.97,77.31 28.73,77.31 IO5.3 | 58.42,78.58 IO14.3 64.14,79.69 69.53,79.69 IO15.3 71.75,79.69 82.23,79.69 IO16.3 | 58.42,78.58 57.31,78.58 56.04,77.31 51.59,77.31 IO13.3 | 60.01,72.95 C48.2 58.58,73.27 58.42,73.11 | C49.2 58.42,73.11 | 58.42,73.11 58.42,78.58 | IO18.3 IO19.3
  Bottom 0.61: EC6.1 EC7.1 EC8.1 | JP2.6 36.35,42.7 34.92,44.13 32.23,44.13 v31.59,43.5 | S31.3 39.05,24.77 37.47,23.18 33.81,23.18 32.23,21.59 v32.23,19.37
  Bottom 0.813: S0.3 11.75,6.35 7.62,10.48 U$4.P$128 U$4.P$127 v7.62,21.59 v7.62,29.69 7.62,31.75 U$3.P$2 7.94,35.88 7.94,43.81 U$2.P$2 8.08,48.4 C3.- 8.08,64.31 U$4.P$64 U$4.P$63 H1.1 | C14.2 98.51,16.91 91.76,10.16 91.76,7.94 5V/3.1 S15.3 87.63,9.53 86.84,10.32 64.29,10.32 62.23,8.26 v60.48,8.26 56.2,8.26 54.29,10.16 v48.42,10.16 46.2,10.16 44.45,8.41 5V/2.1 S7.3 | C17.2 C37.2 | C15.2 C13.2 80.01,22.78 80.01,19.05 | 80.01,19.05 86.84,19.05 A0.3 | 80.01,19.05 v70.8,19.05 64.29,19.05 61.91,21.43 S16.3 | R29.2 R37.2
  Bottom 1.016: S4.3 S5.3 S6.3 S7.3 | C17.2 C15.2 | C37.2 C19.2 C21.2 C23.2 C39.2 C25.2 79.93,43.81 C27.2 | 79.93,46.35 C29.2 C41.2 79.93,52.7 C31.2 79.85,53.42 79.85,55.88 79.93,55.96 | C35.2 79.85,58.5 | A0.3 A1.3 A2.3 A3.3 A4.3 A5.3 A6.3 A7.3 A8.3 A9.3 A10.3 A11.3 A12.3 A13.3 A14.3 89.38,57.94 90.81,59.37 v93.03,59.37 97.47,59.37 98.51,58.34 C16.2 C18.2 C38.2 C20.2 C22.2 98.51,44.6 98.58,44.53 | R7.2 R9.2 R11.2 R31.2 R13.2 R15.2 R17.2 R33.2 R19.2 R21.2 R23.2 R35.2 R25.2 R27.2 86.42,57.15 | 86.42,57.15 R29.2 | C24.2 C40.2 C26.2 C28.2 C30.2 C42.2 C32.2 C34.2 C36.2 C14.2 | 86.42,57.15 79.85,57.15 79.93,57.07 | C35.2 79.93,57.07 | 79.93,57.07 C33.2 | C35.2 C43.2
I2C3_SCL_3V3  (1 unrouted)
  Top 0.305: U$4.P$53 21.59,66.04 21.59,63.66 22.07,63.18 30.8,63.18 31.59,62.39 31.59,54.61 32.86,53.34 32.86,48.9 31.59,47.62 31.59,46.2 33.18,44.61 33.18,41.91 34.92,40.16 34.92,24.92 35.4,24.45 | U3.2 35.17,22.3 34.92,22.54 34.92,23.55 R5.1
I2C3_SDA_3V3
  Top 0.305: U$4.P$54 20.32,63.18 20.95,62.55 30.48,62.55 30.96,62.07 30.96,54.29 32.23,53.02 32.23,49.21 30.96,47.94 30.96,45.88 32.54,44.29 32.54,41.59 34.29,39.85 34.29,25.03 R4.1 33.5,24.23 33.5,23.02 34.72,21.8 U3.3
IO0_3V3
  Bottom 0.305: U$1.3 20.81,70.63 20.48,70.96 IO0.1
IO1_3V3
  Bottom 0.305: U$1.4 21.1,71.29 18.89,73.5 IO1.1
IO2_3V3
  Bottom 0.305: U$1.5 21.44,71.9 20.32,73.03 20.32,75.09 19.37,76.04 IO2.1
IO3_3V3
  Bottom 0.305: U$1.6 21.74,72.56 20.95,73.34 20.95,77.31 19.68,78.58 IO3.1
IO4_3V3
  Bottom 0.305: U$1.7 22.08,73.17 21.59,73.66 21.59,77.31 22.86,78.58 IO4.1
IO5_3V3
  Bottom 0.305: U$1.9 25.86,73.83 24.92,74.77 IO5.1
IO6_3V3
  Bottom 0.305: U$1.10 32.21,73.17 IO6.1
IO7_3V3
  Bottom 0.305: U$1.11 34.14,72.56 IO7.1
IO8_3V3
  Bottom 0.305: U$1.12 36.02,71.9 IO8.1
IO9_3V3
  Bottom 0.305: U$1.13 36.02,71.29 36.35,70.96 IO9.1
IO10_5V
  Top 0.305: U8.20 55.79,69.15 55.4,69.53 IO10.1
IO11_5V
  Top 0.305: U8.18 58.46,70.45 IO11.1
IO12_5V
  Top 0.305: U8.17 58.76,71.1 56.67,73.18 56.67,74.77 IO12.1
IO13_5V
  Top 0.305: U8.16 59.06,71.75 57.31,73.5 57.31,76.68 IO13.1
IO14_5V
  Top 0.305: U8.15 59.37,72.4 57.94,73.82 57.94,77.15 59.21,78.42 61.12,78.42 62.39,77.15 66.67,77.15 IO14.1
IO15_5V
  Top 0.305: U8.14 59.67,73.05 58.58,74.14 58.58,76.83 59.53,77.79 60.8,77.79 62.07,76.52 67.94,76.52 68.1,76.68 68.34,76.91 68.74,77.31 74.45,77.31 IO15.1
IO16_5V  (via drill 0.6)
  Top 0.305: U8.13 59.97,73.7 59.37,74.3 v59.37,75.88
  Bottom 0.305: v59.37,75.88 59.37,77.15 60.01,77.79 60.8,77.79 61.28,77.31 87.15,77.31 IO16.1
IO17_5V  (via drill 0.6)
  Top 0.305: U8.12 61.17,74.35 62.07,75.25 v62.07,75.56
  Bottom 0.305: v62.07,75.56 63.5,75.56 64.29,74.77 71.6,74.77 73.5,76.68 80.8,76.68 82.71,74.77 87.15,74.77 IO17.1
IO18_3V3
  Bottom 0.305: U$5.12 78.59,71.9 80.8,69.69 84.3,69.69 84.61,70.01 84.61,71.6 85.25,72.23 87.15,72.23 IO18.1
IO19_3V3
  Bottom 0.305: U$5.13 78.09,71.29 80.64,68.74 86.2,68.74 IO19.1
N$1
  Top 0.305: U5.9 72.08,40.81 72.39,41.12 C8.1
N$2
  Top 0.305: U6.9 71.93,49.54 72.23,49.85 C12.1
N$3
  Top 0.305: U3.8 U3.7 37.06,22.3 36.51,21.75 36.51,19.6 C4.1 R1.1
N$4
  Top 0.305: A1.2 90.65,25.4 R8.2
N$5  (via drill 0.6)
  Top 0.305: v62.23,68.42 63.98,68.42 64.7,69.15 U8.1
  Bottom 0.305: U$5.3 68.76,70.64 66.83,70.64 64.61,68.42 v62.23,68.42
N$6
  Top 0.305: A2.2 90.65,27.94 R10.2
N$7
  Top 0.305: A0.2 90.65,22.86 R6.2
N$8
  Top 0.305: A4.2 90.65,33.02 R12.2
N$9
  Top 0.305: A5.2 90.65,35.56 R14.2
N$10
  Top 0.305: A6.2 90.65,38.1 R16.2
N$11
  Top 0.305: A8.2 90.65,43.18 R18.2
N$12
  Top 0.305: A9.2 90.65,45.72 R20.2
N$13
  Top 0.305: A10.2 90.65,48.26 R22.2
N$14
  Top 0.305: A12.2 90.65,53.34 R24.2
N$15
  Top 0.305: A13.2 90.65,55.88 R26.2
N$16
  Top 0.305: A14.2 90.65,58.42 R28.2
N$17
  Top 0.305: A3.2 90.65,30.48 R30.2
N$18
  Top 0.305: A7.2 90.65,40.64 R32.2
N$19
  Top 0.305: A11.2 90.65,50.8 R34.2
N$20  (via drill 0.6)
  Top 0.305: U8.3 62.11,70.45 v61.75,70.8
  Bottom 0.305: U$5.4 66.37,71.29 65.56,70.48 62.07,70.48 v61.75,70.8
N$21  (via drill 0.6)
  Top 0.305: U8.4 64.26,71.1 63.6,71.75 v62.55,71.75
  Bottom 0.305: U$5.5 65.71,71.9 65.56,71.75 v62.55,71.75
N$22  (via drill 0.6)
  Top 0.305: U8.5 65,71.75 63.72,73.03 v62.55,73.03
  Bottom 0.305: U$5.6 64.18,72.56 63.72,73.03 v62.55,73.03
N$23  (via drill 0.6)
  Top 0.305: U8.6 65.4,72.4 63.5,74.3 v62.55,74.3
  Bottom 0.305: U$5.7 64.62,73.17 63.5,74.3 v62.55,74.3
N$24  (via drill 0.6)
  Top 0.305: U8.7 71.3,73.05 v72.07,73.82
  Bottom 0.305: v72.07,73.82 72.08,73.83 U$5.9
N$25  (via drill 0.6)
  Top 0.305: U8.8 69.34,73.7 70.41,74.77 v73.03,74.77
  Bottom 0.305: U$5.10 74.12,73.18 75.72,73.18 76.04,73.5 76.04,74.3 75.56,74.77 v73.03,74.77
N$26  (via drill 0.6)
  Top 0.305: U8.9 68.79,74.35 70.17,75.72 v74.14,75.72
  Bottom 0.305: U$5.11 76.37,72.56 76.99,73.18 76.99,74.61 75.88,75.72 v74.14,75.72
PWM_M0_3V3  (via drill 0.6 pad 1.02)
  Top 0.305: U$4.P$85 60.96,18.89 63.18,21.11 63.18,45.72 62.39,46.51 v62.39,48.9
  Bottom 0.305: M0.6 61.28,57.47 62.23,56.52 62.23,49.05 v62.39,48.9
PWM_M1_3V3  (via drill 0.6)
  Top 0.305: U$4.P$51 22.86,67.15 24.13,65.88 31.11,65.88 31.75,65.25 31.75,63.98 33.34,62.39 v33.34,61.75
  Bottom 0.305: M1.6 57.15,58.74 57.15,56.67 56.67,56.2 50.32,56.2 49.53,56.99 49.53,57.94 48.74,58.74 44.61,58.74 43.97,59.37 35.72,59.37 v33.34,61.75
RST_M_3V3  (via drill 0.6 pad 1.02)
  Top 0.305: U$4.P$79 63.98,21.11 63.98,46.2 63.18,46.99 63.18,48.42 63.82,49.05 v65.72,49.05 | 61.28,61.28 v61.44,61.12 60.48,62.07 52.86,62.07 M1.3
  Bottom 0.305: M0.3 M1.3 | v61.44,61.12 62.39,61.12 65.72,57.78 v65.72,49.05
SCL_5V  (via drill 0.6)
  Top 0.305: U3.6 39.73,21.8 40.32,22.38 41.01,22.38 R2.1 43.12,22.49 v43.18,22.54 45.4,24.77 45.4,27.78 45.81,28.19 U2.26 | U1.26 58.17,7.69 60.17,9.68 v60.17,10.64
  Bottom 0.305: v60.17,10.64 60.17,12.38 59.69,12.86 59.69,16.83 58.1,18.41 51.91,18.41 51.59,18.73 I2C.3 51.59,21.59 50.64,22.54 v43.18,22.54
SDA_5V  (via drill 0.6)
  Top 0.305: U3.5 40.99,21.3 R3.1 43.12,21.17 v43.18,21.11 46.04,23.97 46.04,27.3 46.27,27.54 U2.27 | U1.27 57.23,8.34 58.58,9.68 v58.58,10.64
  Bottom 0.305: v58.58,10.64 58.58,11.91 57.15,13.34 57.15,17.14 56.52,17.78 50.32,17.78 49.05,19.05 I2C.2 49.05,21.43 48.58,21.91 45.4,21.91 44.61,21.11 v43.18,21.11
SERVO0_5V  (via drill 0.6)
  Top 0.305: U1.6 48.55,5.74 45.24,9.05 26.51,9.05 v25.4,7.94
  Bottom 0.305: v25.4,7.94 25.4,2.54 S0.1
SERVO1_5V  (via drill 0.6)
  Top 0.305: U1.7 48.25,5.09 44.93,8.41 28.42,8.41 v27.94,7.94
  Bottom 0.305: v27.94,7.94 27.94,2.54 S1.1
SERVO2_5V  (via drill 0.6 pad 1.27)
  Top 0.305: U1.8 47.31,4.44 v46.67,5.08
  Bottom 0.305: S2.1 30.48,2.54 30.48,4.45 31.11,5.08 v46.67,5.08
SERVO3_5V  (via drill 0.6 pad 1.27)
  Top 0.305: v52.07,2.54 50.82,3.79 U1.9
  Bottom 0.305: S3.1 33.02,2.54 v52.07,2.54
SERVO4_5V
  Top 0.305: S4.1 35.56,2.54 35.56,6.99 36.2,7.62 42.55,7.62 43.18,6.99 43.18,5.71 43.81,5.08 45.09,5.08 47.03,3.14 U1.10
SERVO5_5V
  Top 0.305: S5.1 38.1,2.54 38.1,4.45 38.73,5.08 42.55,5.08 43.18,4.45 43.18,3.17 43.87,2.49 U1.11
SERVO6_5V
  Top 0.305: S6.1 40.64,2.54 42.55,2.54 43.25,1.84 U1.12
SERVO7_5V
  Top 0.305: S7.1 41.99,1.19 U1.13
SERVO8_5V
  Top 0.305: U1.15 69.12,0.54 S8.1
SERVO9_5V
  Top 0.305: S9.1 71.12,2.54 68.98,2.54 67.63,1.19 U1.16
SERVO10_5V
  Top 0.305: S10.1 73.66,2.54 73.66,4.45 73.03,5.08 69.22,5.08 65.97,1.84 U1.17
SERVO11_5V  (via drill 0.6 pad 1.27)
  Top 0.305: v65.09,3.17 64.4,2.49 U1.18
  Bottom 0.305: S11.1 76.2,2.54 65.72,2.54 v65.09,3.17
SERVO12_5V  (via drill 0.6 pad 1.27)
  Top 0.305: v66.36,4.45 64.45,4.45 63.15,3.14 U1.19
  Bottom 0.305: S12.1 78.74,2.54 78.74,4.45 78.11,5.08 66.99,5.08 v66.36,4.45
SERVO13_5V  (via drill 0.6 pad 1.27)
  Top 0.305: v66.36,6.35 65.41,6.35 62.84,3.79 U1.20
  Bottom 0.305: S13.1 81.28,2.54 81.28,6.99 80.64,7.62 78.11,7.62 77.15,7.62 67.63,7.62 v66.36,6.35
SERVO14_5V  (via drill 0.6 pad 1.27)
  Top 0.305: v63.82,6.35 61.91,4.44 U1.21
  Bottom 0.305: S14.1 83.82,2.54 83.82,6.99 82.55,8.26 65.72,8.26 v63.82,6.35
SERVO15_5V  (via drill 0.6 pad 1.27)
  Top 0.305: v61.59,6.35 60.33,5.09 U1.22
  Bottom 0.305: S15.1 86.36,2.54 86.36,7.62 85.09,8.89 64.14,8.89 v61.59,6.35
SERVO16_5V
  Top 0.305: U2.6 53.68,30.14 54.93,28.89 54.93,24.77 S16.1
SERVO17_5V
  Top 0.305: U2.7 53.98,30.79 55.56,29.21 55.56,26.67 S17.1
SERVO18_5V
  Top 0.305: U2.8 54.28,31.44 56.83,28.89 S18.1
SERVO19_5V
  Top 0.305: U2.9 55.22,32.09 S19.1
SERVO20_5V
  Top 0.305: U2.10 56.55,32.74 S20.1
SERVO21_5V
  Top 0.305: U2.11 54.66,33.39 S21.1
SERVO22_5V
  Top 0.305: U2.12 54.36,34.04 55.56,35.24 55.56,36.83 S22.1
SERVO23_5V
  Top 0.305: U2.13 51.99,34.69 51.59,35.08 51.59,38.58 S23.1
SERVO24_5V
  Top 0.305: U2.15 44.99,35.34 S24.1
SERVO25_5V
  Top 0.305: U2.16 47.71,34.69 47.94,34.92 47.94,35.88 46.35,37.47 45.4,37.47 S25.1
SERVO26_5V
  Top 0.305: U2.17 48.01,34.04 48.58,34.61 48.58,36.83 S26.1
SERVO27_5V
  Top 0.305: U2.18 48.31,33.39 49.21,34.29 S27.1
SERVO28_5V
  Top 0.305: U2.19 45.05,32.74 S28.1
SERVO29_5V
  Top 0.305: U2.20 45.11,32.09 S29.1
SERVO30_5V
  Top 0.305: U2.21 45.73,31.44 45.4,31.11 45.4,30.48 44.13,29.21 S30.1
SERVO31_5V  (via drill 0.6 pad 1.02)
  Top 0.305: U2.22 47.94,30.8 49.21,32.07 v49.21,33.02
  Bottom 0.305: v49.21,33.02 45.4,29.21 45.4,27.3 S31.1
SNS_M0_3V3
  Bottom 0.305: U$4.P$44 37.78,60.01 43.81,60.01 45.09,61.28 53.98,61.28 54.61,60.64 54.61,58.74 M0.5
SNS_M1_3V3
  Bottom 0.305: U$4.P$43 34.29,66.04 34.29,64.29 37.94,60.64 43.66,60.64 44.93,61.91 55.09,61.91 55.88,61.12 M1.5
SPI4_MISO_3V3  (via drill 0.6)
  Top 0.305: U4.3 69.65,55.37 v71.28,56.99 | U$4.P$14 v71.12,60.64
  Bottom 0.305: v71.12,60.64 71.12,57.15 v71.28,56.99
SPI4_MISO_5V
  Top 0.305: U4.18 61.4,55.37 60.96,54.93 60.96,52.07 59.69,50.8 59.69,49.21 59.05,48.58 54.61,48.58 ENC0.4
  Bottom 0.305: ENC0.4 ENC1.4 GYRO.4
SPI4_MOSI_3V3
  Top 0.305: U4.1 70.89,54.07 74.93,58.1 74.93,66.04 U$4.P$11
SPI4_MOSI_5V  (via drill 0.6)
  Top 0.305: v52.07,48.74 52.07,48.42 52.55,47.94 59.37,47.94 60.33,48.9 60.33,50.48 61.59,51.75 61.59,53.82 61.84,54.07 U4.20
  Bottom 0.305: GYRO.5 ENC1.5 ENC0.5 54.77,48.74 v52.07,48.74
SPI4_SCK_3V3
  Top 0.305: U4.4 67.33,56.02 66.52,56.83 66.52,63.66 67.47,64.61 67.47,66.2 U$4.P$15
SPI4_SCK_5V
  Top 0.305: U4.17 61.1,56.02 60.33,55.24 60.33,52.39 59.05,51.12 52.07,51.12 ENC0.3
  Bottom 0.305: GYRO.3 ENC1.3 ENC0.3
SPI5_MISO_3V3  (via drill 0.6)
  Top 0.305: U7.3 79.09,23.14 81.28,20.95 U$4.P$69 | v96.84,20.16 97.79,21.11 97.79,61.28 v96.04,63.02 | v70.64,70.8 74.45,70.8 74.93,70.33 74.93,69.06 75.41,68.58 84.3,68.58 84.93,67.94 84.93,64.14 85.57,63.5 v91.12,63.5 | v48.1,69.37 33.97,69.37 v33.02,70.33 29.05,70.33 28.57,69.85 16.03,69.85 v15.56,69.37
  Top 0.406: EC6.4 EC7.4 EC8.4 EC9.4 EC10.4 EC11.4 EC12.4 EC13.4
  Bottom 0.305: EC6.4 20.32,54.93 18.26,54.93 17.78,55.4 17.78,63.18 16.67,64.29 16.67,68.26 v15.56,69.37 | U$1.14 32.72,70.63 v33.02,70.33 | U$4.P$69 82.55,17.78 88.11,17.78 90.49,20.16 v96.84,20.16 | U$5.14 70.81,70.63 v70.64,70.8 | v96.04,63.02 95.57,63.5 v91.12,63.5 90.33,62.71 56.52,62.71 55.72,63.5 53.02,63.5 52.07,64.45 52.07,68.58 51.28,69.37 v48.1,69.37
SPI5_MISO_5V  (via drill 0.6)
  Top 0.305: U5.15 72.06,37 v73.34,35.72 71.91,34.29 71.6,33.97 71.28,33.66 71.28,23.97 70.45,23.14 U7.18 | v72.39,45.09 72.39,45.4 72.07,45.72 U6.15
  Top 0.406: EC3.4 EC4.4 EC5.4
  Bottom 0.305: v73.34,35.72 72.07,36.99 72.07,44.77 v72.39,45.09 71.75,45.72 44.61,45.72 42.7,47.62 42.7,56.36 42.23,56.83 32.86,56.83 30.96,54.93 22.86,54.93 EC5.4
SPI5_MOSI_3V3  (via drill 0.6)
  Top 0.305: U7.1 75.16,21.84 77.47,19.53 77.47,15.24 U$4.P$72 | EC6.5 18.41,53.66 17.14,54.93 15.88,54.93 15.24,55.56 15.24,62.87 14.61,63.5 12.06,63.5 11.43,64.14 11.43,67.79 12.06,68.42 16.83,68.42 17.62,69.22 v31.75,69.22 32.38,68.58 46.2,68.58 46.99,67.79 v46.99,66.2 | v96.84,17.14 99.38,19.68 99.38,62.55 v98.58,63.34 | v70.64,69.22 73.66,69.22 74.77,68.1 74.77,67.15 76.04,65.88 82.07,65.88 82.55,65.41 82.55,63.82 82.87,63.5 83.82,63.5 84.61,62.71 88.27,62.71 88.9,62.07 v91.12,62.07
  Top 0.406: EC6.5 EC7.5 EC8.5 EC9.5 EC10.5 EC11.5 EC12.5 EC13.5
  Bottom 0.305: U$1.15 30.94,70.02 v31.75,69.22 | U$4.P$72 80.8,11.91 91.6,11.91 v96.84,17.14 | U$5.15 71.45,70.02 v70.64,69.22 | v46.99,66.2 48.74,66.2 49.53,65.41 49.53,64.14 50.96,62.71 55.24,62.71 55.88,62.07 v91.12,62.07 97.31,62.07 v98.58,63.34
SPI5_MOSI_5V  (via drill 0.6)
  Top 0.305: U5.14 72.88,37.61 v73.34,37.15 74.3,36.2 74.3,35.24 72.39,33.34 72.07,33.02 71.91,32.86 71.91,23.5 70.26,21.84 U7.20 | v73.34,45.88 72.88,46.34 U6.14
  Top 0.406: EC3.5 EC4.5 EC5.5
  Bottom 0.305: v73.34,37.15 v73.34,45.88 72.71,46.51 44.77,46.51 43.34,47.94 43.34,56.99 42.86,57.47 20.32,57.47 EC5.5
SPI5_SCK_3V3  (via drill 0.6)
  Top 0.305: U7.4 73.74,23.81 79.38,23.81 82.55,20.64 82.55,15.24 U$4.P$70 | EC6.3 22.86,54.93 18.41,54.93 17.78,55.56 17.78,62.87 19.05,64.14 v19.05,68.26 | v96.84,18.73 98.58,20.48 98.58,61.91 97.47,63.02 97.47,63.82 v96.52,64.77 | v32.23,66.04 45.88,66.04 46.83,65.09 46.83,63.98 47.78,63.02 53.66,63.02 54.61,63.98 v54.61,66.04
  Top 0.406: EC6.3 EC7.3 EC8.3 EC9.3 EC10.3 EC11.3 EC12.3 EC13.3
  Bottom 0.305: v19.05,68.26 20.16,69.37 23.36,69.37 U$1.1 25.57,69.36 26.67,68.26 26.67,66.52 27.15,66.04 v32.23,66.04 | U$4.P$70 82.55,12.7 90.81,12.7 v96.84,18.73 | U$5.1 68.77,69.03 69.69,68.1 69.69,65.72 | 69.69,65.72 69.69,64.14 68.9,63.34 57.47,63.34 57.15,63.66 57.15,65.56 56.67,66.04 v54.61,66.04 | 69.69,65.72 69.85,65.88 84.77,65.88 84.93,65.72 84.93,64.29 85.57,63.66 88.27,63.66 89.38,64.77 v96.52,64.77
SPI5_SCK_5V  (via drill 0.6)
  Top 0.305: v74.3,38.26 74.28,38.27 U5.13 69.37,38.26 69.06,37.94 69.06,35.4 70.64,33.81 70.64,24.61 69.83,23.79 U7.17 | v74.3,46.99 U6.13 | 24.13,58.1 EC3.3
  Top 0.406: EC4.3 24.13,58.1 EC5.3
  Bottom 0.305: v74.3,38.26 v74.3,46.99 74.14,47.15 45.09,47.15 43.97,48.26 43.97,57.47 43.34,58.1 32.86,58.1 30.96,60.01 25.4,60.01 EC3.3
U1RX_3V3  (via drill 0.6 pad 1.02)
  Top 0.305: JP2.5 59.53,45.24 60.01,44.77 v60.01,43.81 | v66.67,44.77 v66.67,48.1 | U$4.P$24 58.42,63.34 59.05,62.71 62.23,62.71 v63.82,61.12
  Bottom 0.305: v60.01,43.81 62.55,43.81 64.29,42.07 67.79,42.07 68.26,42.55 68.26,44.29 67.79,44.77 v66.67,44.77 | v63.82,61.12 66.67,58.26 v66.67,48.1
U1TX_3V3  (via drill 0.6 pad 1.02)
  Top 0.305: U$4.P$52 23.81,63.82 30.96,63.82 32.23,62.55 32.23,54.93 33.5,53.66 33.5,49.21 33.5,49.05 33.5,47.31 v32.7,46.51
  Bottom 0.305: JP2.4 33.97,47.78 v32.7,46.51
V+  (via drill 0.6 pad 1.02)
  Top 0.305: v3.17,10.16 v12.06,10.16 | v89.53,10.48 95.73,16.67 v95.73,60.96 | v87.63,60.96 R36.2
  Bottom 0.305: U$3.P$1 3.17,33.66 v3.17,10.16 | v12.06,10.16 24.92,10.16 26.04,11.27 54.77,11.27 56.52,9.53 61.28,9.53 63.18,11.43 88.58,11.43 v89.53,10.48 | v95.73,60.96 v87.63,60.96
  Bottom 0.813: H7.1 2.08,61.45 C3.+ 2.08,52.21 U$2.P$1 2.22,45.09 2.22,39.69 U$3.P$1

## Text on the board
bPlace: Interface board / espitall / 2015
bNames: 5V | 5V | GND | GND